# EAGLE design esp12e-test (EAGLE 9.6.2)
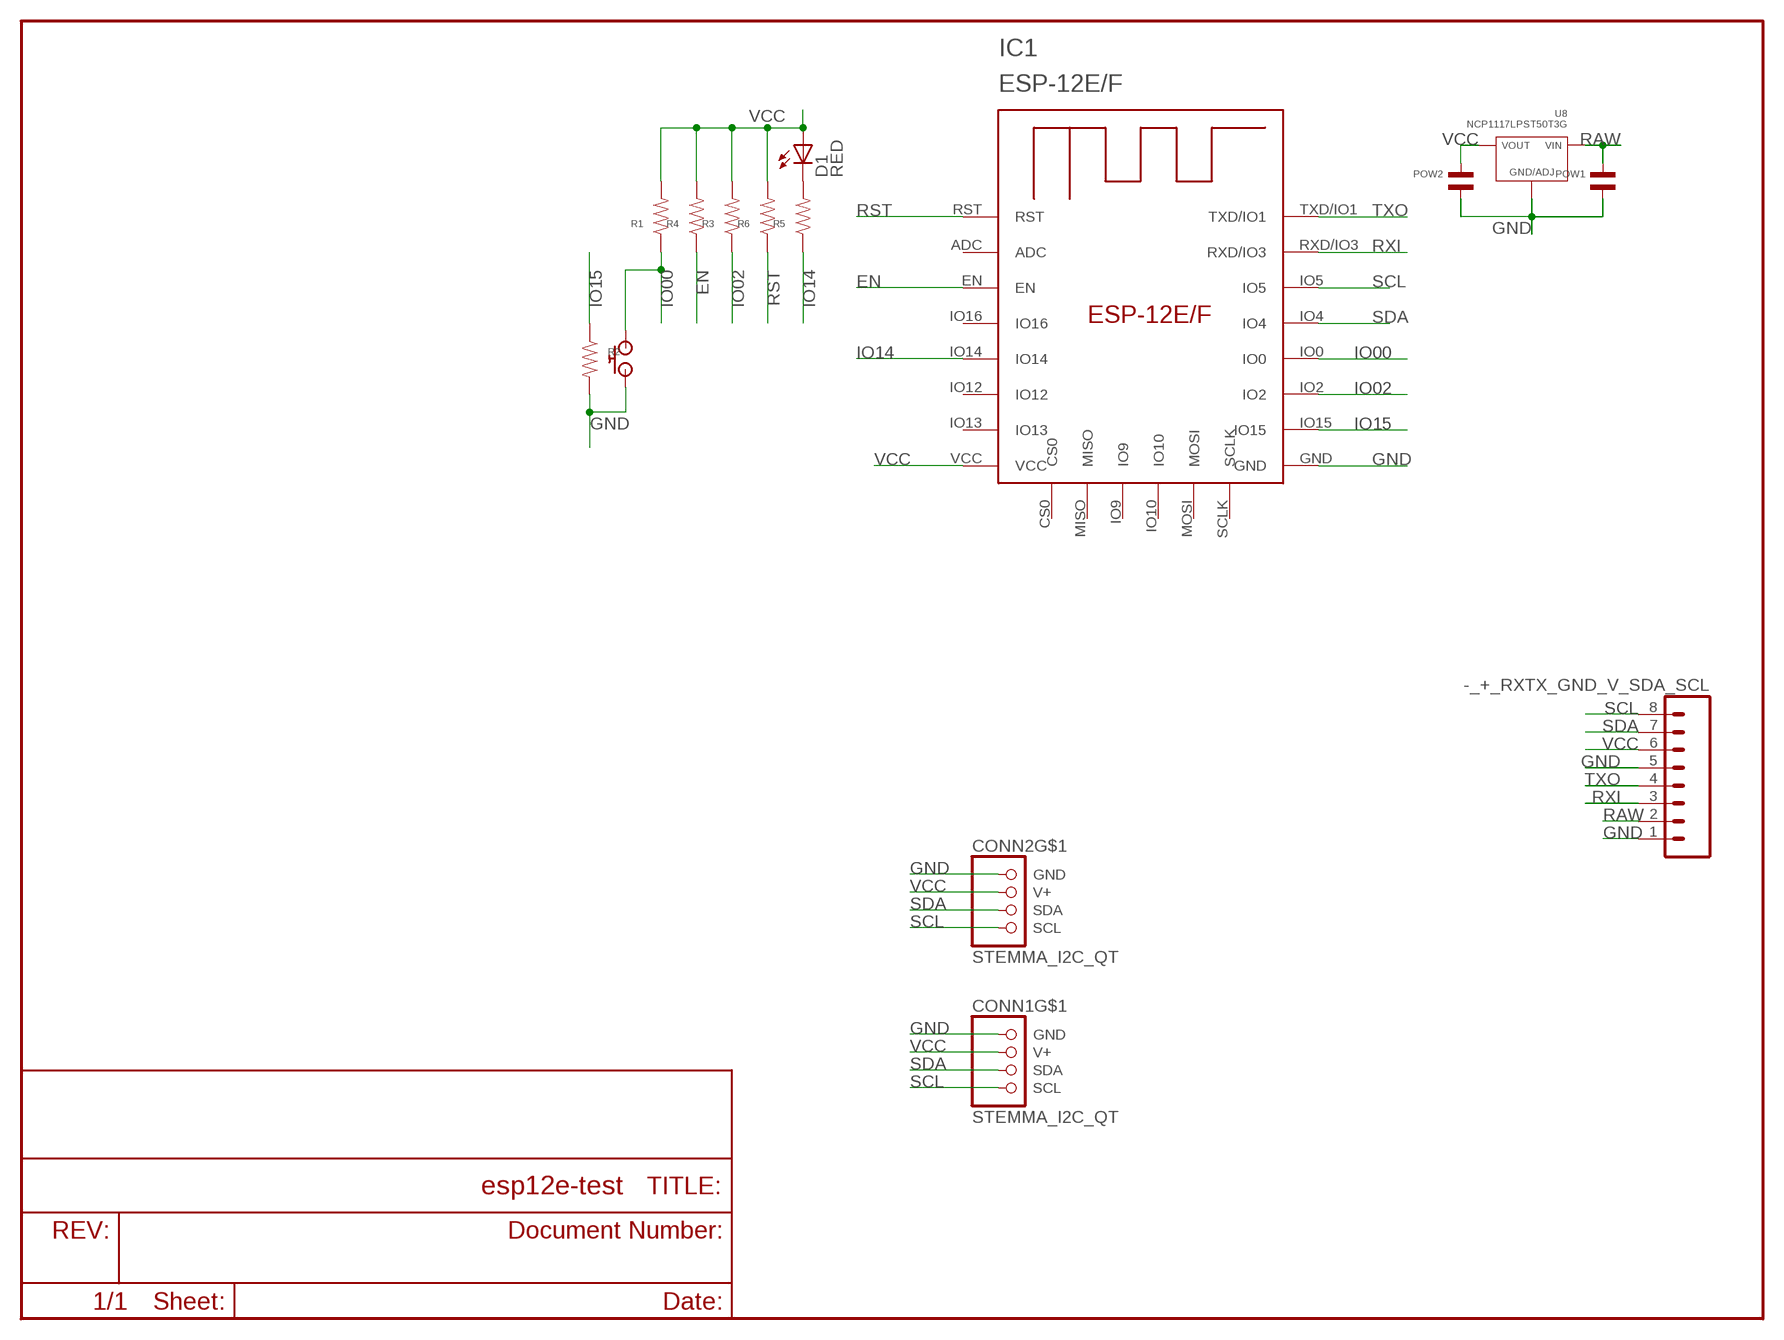
[diagram p0: schematic, sheet 1]

## Parts
-_+_RXTX_GND_V_SDA_SCL  MF-CON-2.54mm-01x08  M081X08  [1X08]
CONN1  STEMMA_I2C_QT  [JST_SH4]
CONN2  STEMMA_I2C_QT  [JST_SH4]
D1  RED  LED-RED0603  [LED-0603]
IC1  ESP-12E/F  [ESP-12E]
POW1  CAPACITOR_NP_1210  [C1210]
POW2  CAPACITOR_NP_1210  [C1210]
R1  RESISTOR_0603  [R0603]
R2  RESISTOR_0603  [R0603]
R3  RESISTOR_0603  [R0603]
R4  RESISTOR_0603  [R0603]
R5  RESISTOR_0603  [R0603]
R6  RESISTOR_0603  [R0603]
U8  NCP1117LPST50T3G  [SOT-223-3]
U$1  AMAZON_BUTTON  [AMAZON_BUTTON]

## Nets
EN: IC1.EN R4.P$1
GND [hc]: -_+_RXTX_GND_V_SDA_SCL.1 -_+_RXTX_GND_V_SDA_SCL.5 CONN1.1(GND) CONN2.1(GND) IC1.GND POW1.P$2 POW2.P$2 R2.P$2 U8.P$2(GND/ADJ) U$1.2 U$1.3
IO00: IC1.IO0 R1.P$1 U$1.1 U$1.4
IO02: IC1.IO2 R3.P$1
IO14: IC1.IO14 R5.P$1
IO15: IC1.IO15 R2.P$1
N$2: D1.C R5.P$2
RAW: -_+_RXTX_GND_V_SDA_SCL.2 POW1.P$1 U8.P$4(VIN)
RST: IC1.RST R6.P$1
RXI: -_+_RXTX_GND_V_SDA_SCL.3 IC1.RXD/IO3
SCL: -_+_RXTX_GND_V_SDA_SCL.8 CONN1.4(SCL) CONN2.4(SCL) IC1.IO5
SDA: -_+_RXTX_GND_V_SDA_SCL.7 CONN1.3(SDA) CONN2.3(SDA) IC1.IO4
TXO: -_+_RXTX_GND_V_SDA_SCL.4 IC1.TXD/IO1
VCC [hc]: -_+_RXTX_GND_V_SDA_SCL.6 CONN1.2(V+) CONN2.2(V+) D1.A IC1.VCC POW2.P$1 R1.P$2 R3.P$2 R4.P$2 R6.P$2 U8.P$1(VOUT) U8.P$3(VOUT)
Unconnected: CONN1.MT1(MT) CONN1.MT2(MT) CONN2.MT1(MT) CONN2.MT2(MT) IC1.ADC IC1.CS0 IC1.IO9 IC1.IO10 IC1.IO12 IC1.IO13 IC1.IO16 IC1.MISO IC1.MOSI IC1.SCLK

## Library data of the parts
-_+_RXTX_GND_V_SDA_SCL = SparkFun-Connectors:M08: Header 8 Standard 8-pin 0.1" header. Use with straight break away headers (SKU : PRT-00116), right angle break away headers (PRT-00553), swiss pins (PRT-00743), machine pins (PRT-00117), and female headers (PRT-00115).
CONN1 CONN2 = 00jim:STEMMA_I2C
D1 = 00jim:LED-RED: Assorted Red LEDs LilyPad 1206- DIO-09912 1206- DIO-00809 0603- DIO-00819; PROD_ID: DIO-00819
IC1 = esp-12e-f:ESP-12E/F
POW1 POW2 = MF_Passives:CAPACITOR_NP: Library: MF_Passives Description: Device for Non-Polarized Capacitors. Manufacture part number (MPN) can be added via Attributes. Check https://factory.macrofab.com/parts for the house parts list.; POPULATE: 1
R1-R6 = 00jim:RESISTOR: Library: MF_Passives Description: Device for Resistors. Manufacture part number (MPN), Voltage, Tolerance, and Wattage Rating can be added via Attributes. Check https://factory.macrofab.com/parts for the house parts list.; POPULATE: 1
U8 = MF_IC_Power:NCP1117LP: Manufacturer Part #: NCP1117LP Manufacturer: ON Semiconductor Description: LDO Voltage Regulators; HOUSEPART: NO; MPN: NCP1117LPST50T3G; POPULATE: 1; URL: http://www.onsemi.com/pub_link/Collateral/NCP1117LP-D.PDF
U$1 = 00jim:AMAZON_BUTTON

## Net classes
1 vcc: width 0.762 mm
3 hc: width 0.762 mm

## Board
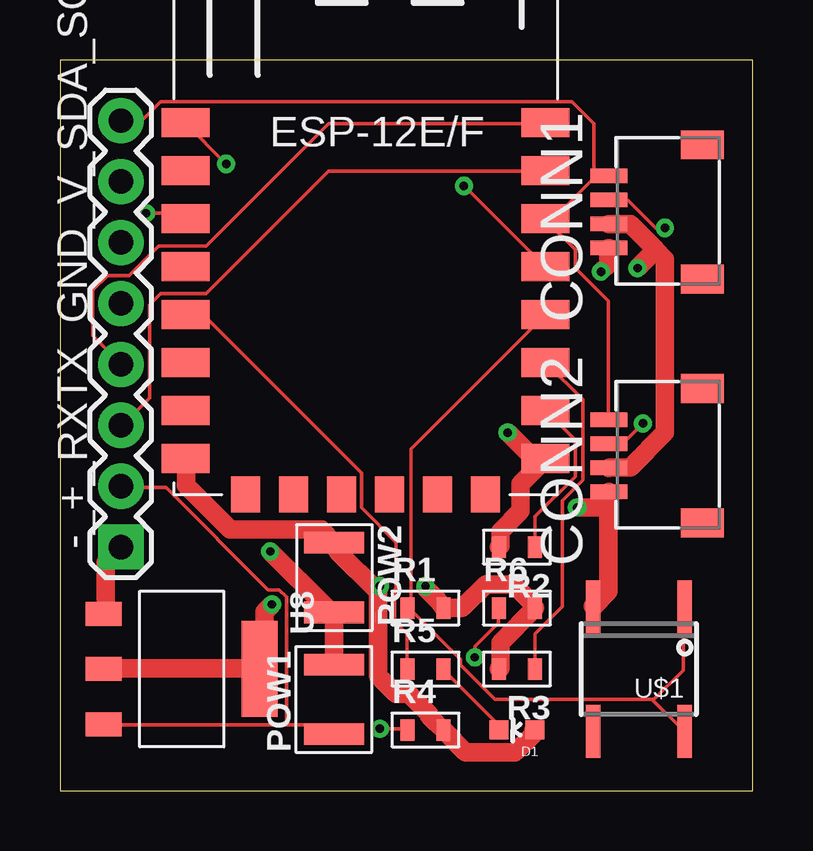
[diagram p1: board, top side]
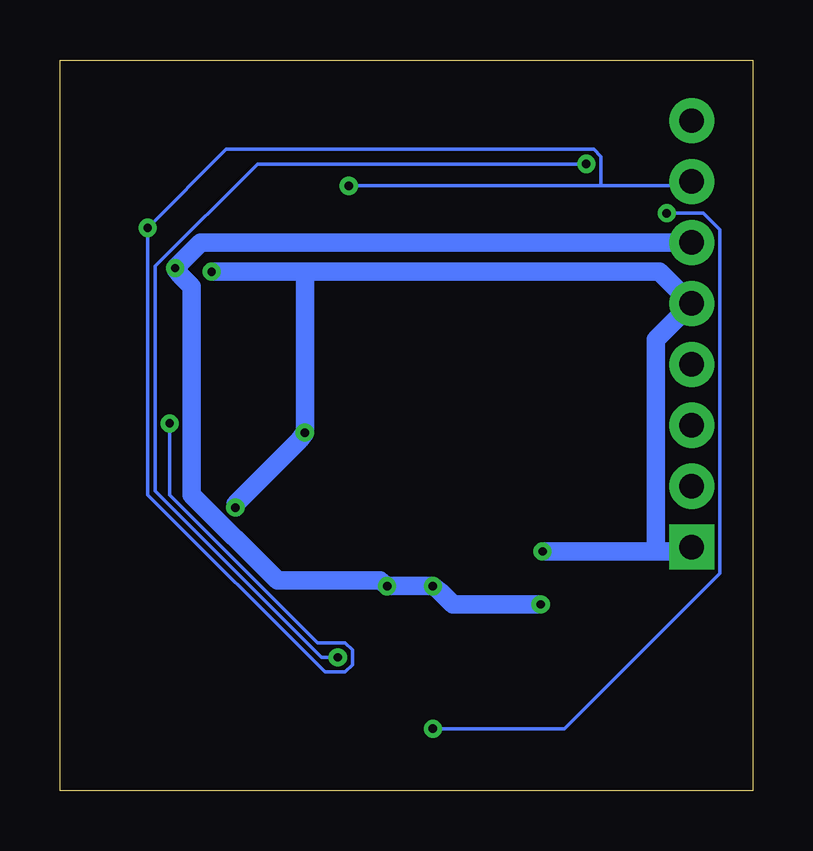
[diagram p2: board, bottom side, seen from below]

Size 28.88 x 30.47 mm. Coordinates in mm from the lower left corner, seen from the top.
Outline: 0,0 28.88,0 28.88,30.47 0,30.47 0,0
Copper layers (1*16): Top 0.035mm / dielectric 1.5mm / Bottom 0.035mm
Design rules "default *": minimum track width 6mil, minimum drill 0.35mm, track to track 6mil, track to pad 6mil, pad to pad 6mil, via to via 6mil, smd to smd 6mil, copper to edge 40mil, drill to drill 6mil, minimum pad ring 10mil, minimum via ring 8mil, stop-mask expansion 4mil, vias tented up to drill 0mil, thermal gap 10mil

### Footprints (pad centres in the part's own frame; a part is rotated, then mirrored left to right if it is on the bottom)
1X08 = drill 1.016 pad 1.88 square: 1 0,0 | drill 1.016 pad 1.88: 2 2.54,0; 3 5.08,0; 4 7.62,0; 5 10.16,0; 6 12.7,0; 7 15.24,0; 8 17.78,0
JST_SH4 = smd 0.6 x 1.55: 1 -1.5,2.514; 2 -0.5,2.514; 3 0.5,2.514; 4 1.5,2.514 | smd 1.2 x 1.8: MT1 -2.8,-1.386; MT2 2.8,-1.386
LED-0603 = smd 0.8 x 0.8: A 0,-0.75; C 0,0.75
ESP-12E = smd 2 x 1.2: ADC -7.46,5.53; EN -7.46,3.53; GND 7.54,-6.47; IO0 7.54,-0.47; IO2 7.54,-2.47; IO4 7.54,1.53; IO5 7.54,3.53; IO12 -7.46,-2.47; IO13 -7.46,-4.47; IO14 -7.46,-0.47; IO15 7.54,-4.47; IO16 -7.46,1.53; RST -7.46,7.53; RXD/IO3 7.54,5.53; TXD/IO1 7.54,7.53; VCC -7.46,-6.47 | smd 1.2 x 1.5: CS0 -4.96,-7.97; IO9 -0.96,-7.97; IO10 1.04,-7.97; MISO -2.96,-7.97; MOSI 3.04,-7.97; SCLK 5.04,-7.97
C1210 = smd 0.9 x 2.5: P$1 -1.45,0; P$2 1.45,0
R0603 = smd 0.6 x 0.9: P$1 -0.75,0; P$2 0.75,0
SOT-223-3 = smd 1.5 x 4: P$1 3.25,0 | smd 1.5 x 1: P$2 -3.25,2.3; P$3 -3.25,0; P$4 -3.25,-2.3
AMAZON_BUTTON = smd 0.6 x 2.2: 1 -1.905,-2.6; 2 1.905,-2.6; 3 1.905,2.6; 4 -1.905,2.6

### Placement (x,y rotation side)
-_+_RXTX_GND_V_SDA_SCL  2.54,10.16 90 top
CONN1  25.4,24.13 90 top
CONN2  25.4,13.97 90 top
D1  19.05,2.54 90 top
IC1  12.7,20.32 0 top
POW1  11.43,3.81 90 top
POW2  11.43,8.89 270 top
R1  15.24,7.62 0 top
R2  19.05,10.16 180 top
R3  19.05,5.08 180 top
R4  15.24,2.54 0 top
R5  15.24,5.08 0 top
R6  19.05,7.62 0 top
U8  5.08,5.08 0 top
U$1  24.13,5.08 180 top

### Tracks (layer width: path | path; a pad name or v marks a point on that pad's centre or on a via)
EN  (via drill 0.35)
  Top 0.152: v13.34,2.59 14.48,2.59 R4.P$1 | v3.58,24.08 4.95,24.08 5.18,23.85 IC1.EN
  Bottom 0.152: v13.34,2.59 7.85,2.59 1.37,9.07 1.37,23.39 2.06,24.08 v3.58,24.08
GND  (via drill 0.35)
  Top 0.762: POW1.P$2 POW2.P$2 11.12,7.62 v8.76,9.98 | -_+_RXTX_GND_V_SDA_SCL.1 1.91,9.53 1.91,7.39 U8.P$2 | 22.86,11.81 22.86,8.31 22.25,7.7 U$1.2 | 22.86,11.81 22.86,12.42 CONN2.1 | R2.P$2 18.36,10.21 18.36,10.82 19.2,11.66 19.2,12.8 20.19,13.79 IC1.GND 19.74,13.87 v18.67,14.94 | v22.55,21.64 22.86,21.95 22.86,22.55 CONN1.1 | v21.57,11.81 22.86,11.81
  Bottom 0.762: 4.04,9.98 2.74,9.98 2.59,10.13 -_+_RXTX_GND_V_SDA_SCL.1 | 4.04,9.98 v8.76,9.98 | 18.67,21.64 3.89,21.64 2.59,20.34 -_+_RXTX_GND_V_SDA_SCL.5 4.04,18.82 4.04,9.98 | 18.67,21.64 v22.55,21.64 | 18.67,21.64 v18.67,14.94 18.9,14.63 21.57,11.96 v21.57,11.81
IO00
  Top 0.152: 24.73,3.77 25.98,2.52 U$1.4 | 24.73,3.77 24.69,3.81 18.14,3.81 16.69,5.26 16.69,5.49 14.55,7.62 R1.P$1 14.63,7.62 14.63,14.25 20.19,19.81 IC1.IO0 | 24.73,3.77 25.98,5.03 25.98,7.62 U$1.1
IO02
  Top 0.152: R3.P$1 19.81,5.11 19.81,6.55 20.95,7.7 20.95,12.12 21.79,12.95 21.79,16.31 20.27,17.83 IC1.IO2
IO14
  Top 0.152: R5.P$1 14.48,5.11 14.48,6.55 13.95,7.09 13.95,8.38 14.02,8.46 14.02,10.36 12.57,11.81 12.57,13.26 6.02,19.81 5.26,19.81 IC1.IO14
IO15
  Top 0.152: R2.P$1 19.81,10.21 19.81,11.43 21.49,13.11 21.49,14.63 20.27,15.85 IC1.IO15
N$2
  Top 0.152: D1.C 18.29,2.59 18.29,2.74 16,5.03 R5.P$2
RAW
  Top 0.152: 9.45,2.74 11.05,2.74 POW1.P$1 | 9.45,2.74 1.91,2.74 U8.P$4 | 9.45,2.74 9.45,8.08 9.14,8.38 8.69,8.38 4.42,12.65 2.59,12.65 -_+_RXTX_GND_V_SDA_SCL.2
RST  (via drill 0.35)
  Top 0.152: v17.3,5.56 17.3,6.02 18.29,7.01 18.29,7.62 R6.P$1 | v6.93,26.14 5.26,27.81 IC1.RST
  Bottom 0.152: v17.3,5.56 17.98,5.56 24.92,12.5 24.92,21.87 20.65,26.14 v6.93,26.14
RXI
  Top 0.152: IC1.RXD/IO3 20.19,25.83 11.2,25.83 6.1,20.73 4.19,20.73 3.73,20.27 3.73,16.38 2.59,15.24 -_+_RXTX_GND_V_SDA_SCL.3
SCL
  Top 0.152: CONN2.4 22.86,15.54 22.86,20.42 21.49,21.79 21.49,22.55 20.27,23.77 IC1.IO5 20.42,23.7 22.33,25.6 22.86,25.6 CONN1.4 22.25,25.6 22.25,27.81 21.34,28.73 4.19,28.73 3.43,27.96 2.59,27.96 -_+_RXTX_GND_V_SDA_SCL.8
SDA  (via drill 0.35)
  Top 0.152: v16.84,25.22 20.19,21.87 IC1.IO4 | v24.31,15.32 23.47,14.48 22.94,14.48 CONN2.3 | v25.22,23.47 24.84,23.47 23.7,24.61 22.94,24.61 CONN1.3
  Bottom 0.152: 6.33,25.22 2.74,25.22 2.59,25.38 -_+_RXTX_GND_V_SDA_SCL.7 | 6.33,25.22 v16.84,25.22 | v24.31,15.32 24.31,12.34 18.14,6.17 16.99,6.17 16.69,5.87 16.69,5.26 16.99,4.95 17.83,4.95 25.22,12.34 v25.22,23.47 21.95,26.75 6.63,26.75 6.33,26.44 6.33,25.22
TXO
  Top 0.152: IC1.TXD/IO1 20.19,27.81 11.2,27.81 6.1,22.71 4.12,22.71 2.9,21.49 1.98,21.49 1.37,20.88 1.37,18.97 2.52,17.83 -_+_RXTX_GND_V_SDA_SCL.4
VCC  (via drill 0.35)
  Top 0.762: U8.P$3 1.91,5.11 8.31,5.11 U8.P$1 8.53,5.41 8.53,7.47 v8.84,7.77 | R3.P$2 18.36,5.11 18.36,6.17 19.81,7.62 R6.P$2 19.58,7.92 18.9,8.61 17.75,8.61 16.76,7.62 R1.P$2 15.77,7.92 15.24,8.46 v15.24,8.53 | D1.A 19.74,2.52 19.74,2.36 18.97,1.6 16.92,1.6 16,2.52 R4.P$2 15.7,2.82 15.39,3.12 15.39,3.2 14.55,4.04 14.02,4.04 13.26,4.8 13.26,8.31 | IC1.VCC 5.26,13.79 5.26,12.72 7.09,10.9 10.9,10.9 11.43,10.36 POW2.P$1 11.58,9.98 13.26,8.31 | v13.34,8.53 13.26,8.31 | 24.84,22.55 23.77,23.62 22.94,23.62 CONN1.2 | 24.84,22.55 25.22,22.17 25.22,14.94 23.77,13.49 22.94,13.49 CONN2.2 | 24.84,22.55 v24.08,21.79
  Bottom 0.762: v8.84,7.77 12.5,7.77 13.03,8.31 v13.34,8.53 v15.24,8.53 15.54,8.76 19.81,8.76 23.39,12.34 23.39,21.03 23.85,21.49 v24.08,21.79 23.01,22.86 -_+_RXTX_GND_V_SDA_SCL.6